# Altium schematic sheet Schematic.SchDoc
size 393 x 281 mm; SheetNumber: 1; SheetTotal: 1
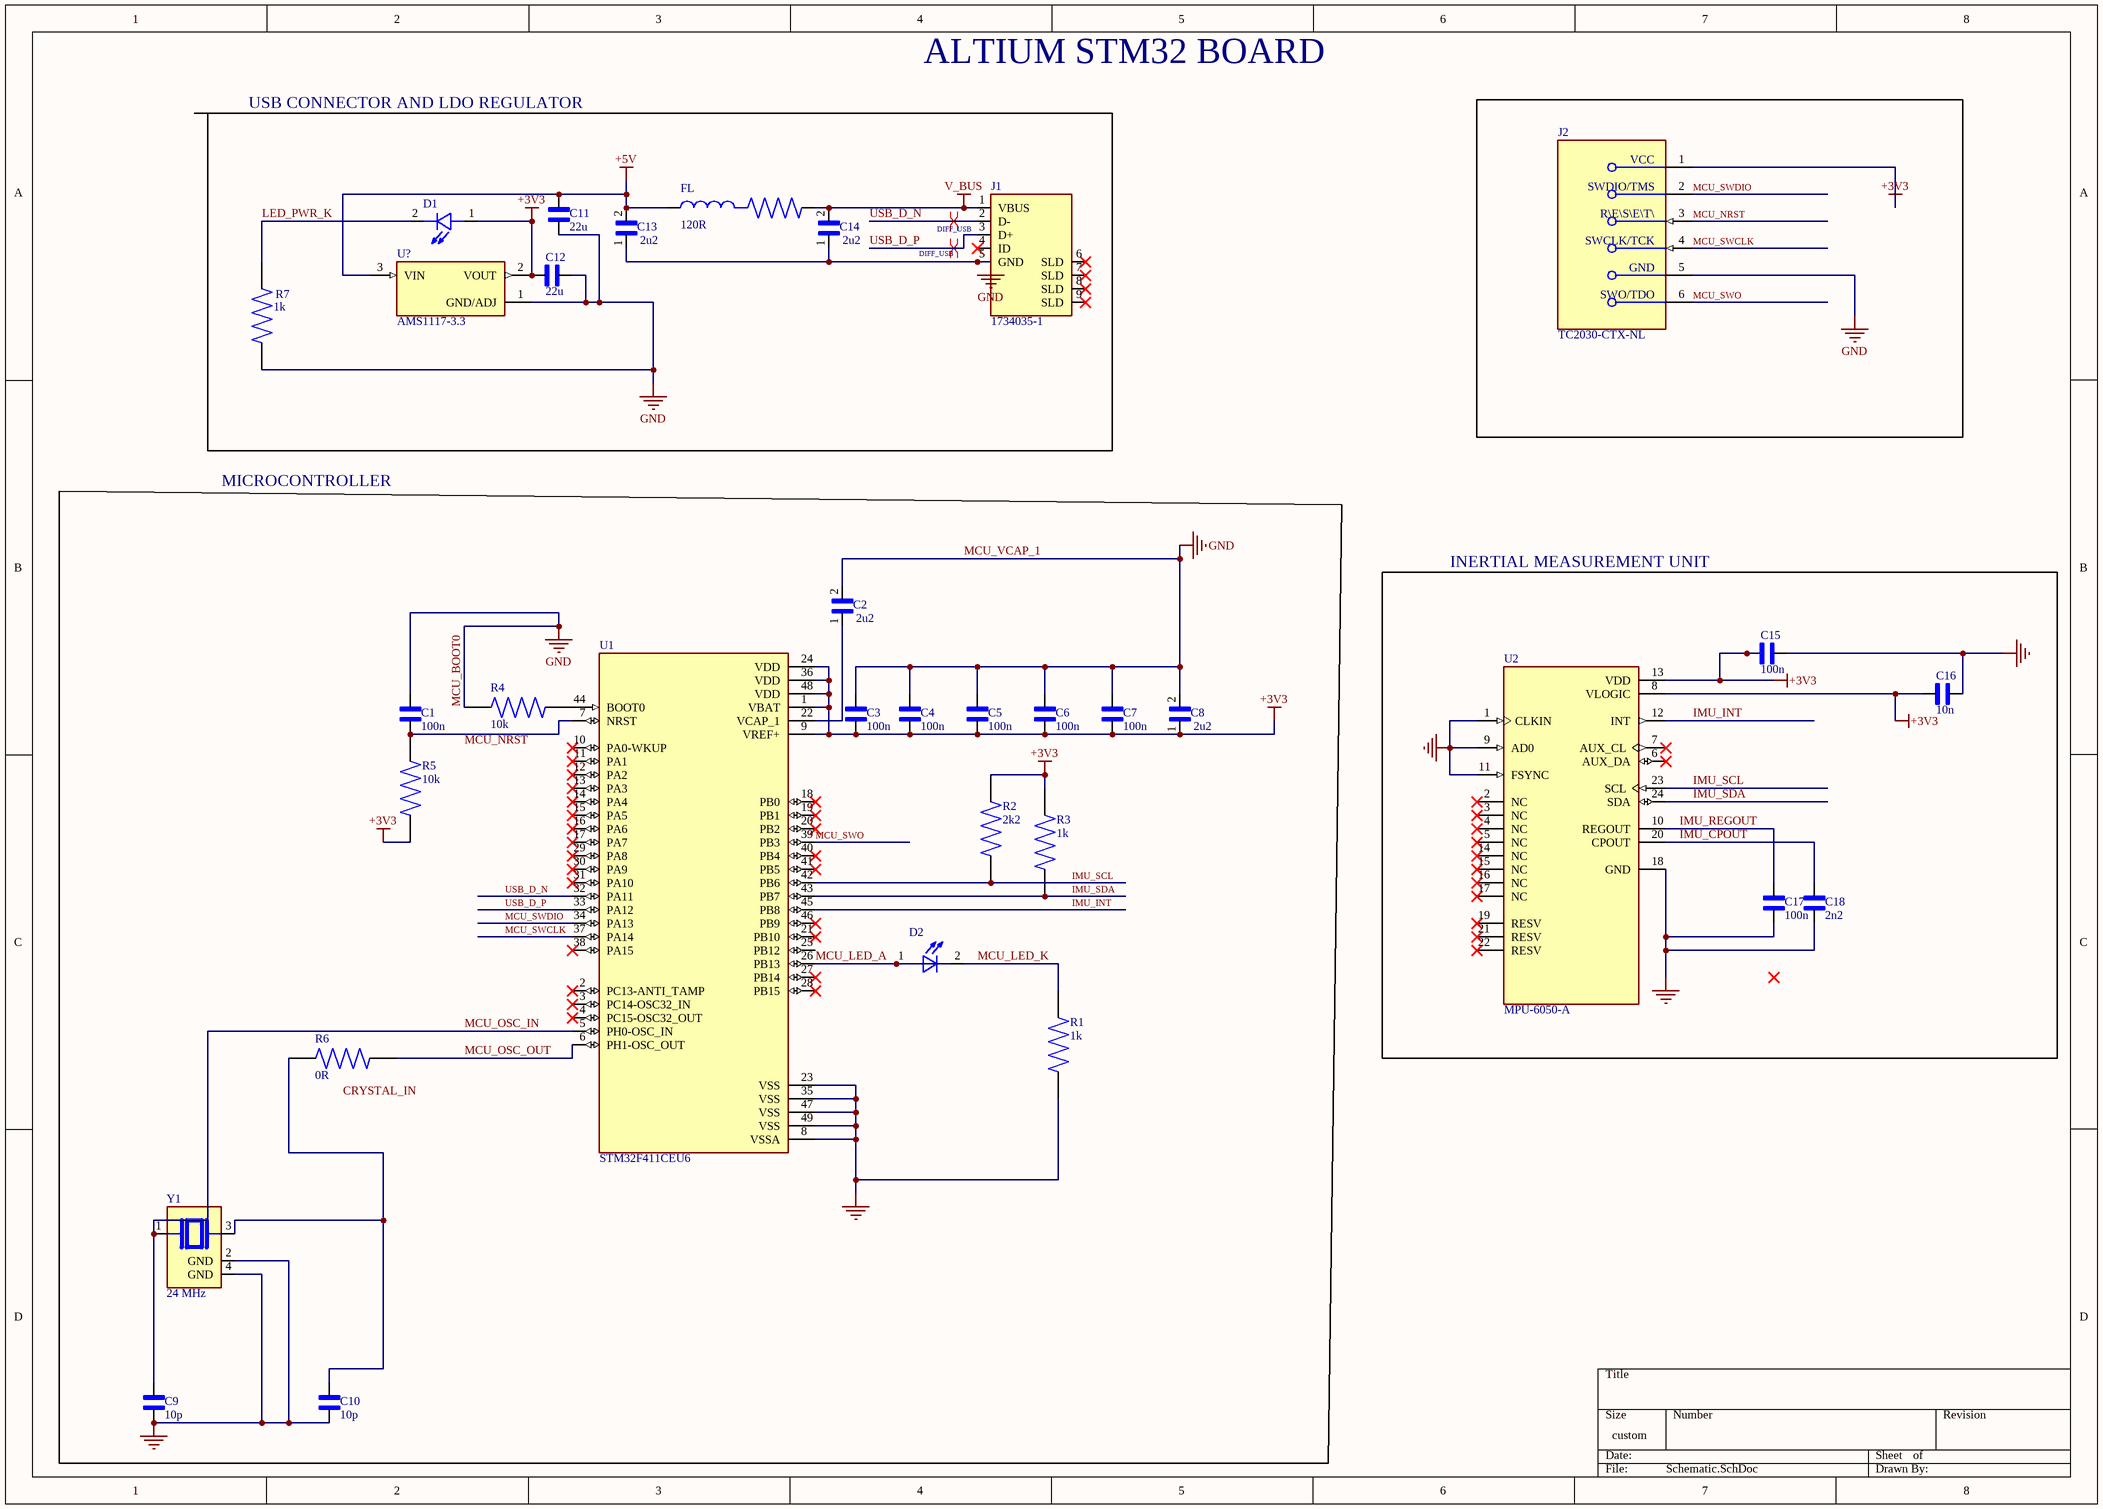
[diagram p0: Schematic.SchDoc]

## Parts
C1  100n  [CAPC1005X55N]
C2  2u2  [CAPC1608X90N]
C3  100n  [CAPC1005X55N]
C4  100n  [CAPC1005X55N]
C5  100n  [CAPC1005X55N]
C6  100n  [CAPC1005X55N]
C7  100n  [CAPC1005X55N]
C8  2u2  [CAPC1608X90N]
C9  10p  [CAPC1005X55N]
C10  10p  [CAPC1005X55N]
C11  22u  [CAPC2012X88N]
C12  22u  [CAPC2012X88N]
C13  2u2  [CAPC1608X90N]
C14  2u2  [CAPC1608X90N]
C15  100n  [CAPC1005X55N]
C16  10n  [CAPC1005X55N]
C17  100n  [CAPC1005X55N]
C18  2n2  [CAPC1005X55N]
D1  (no value)  [LED_XZMG54W-1]
D2  (no value)  [LED_XZMG54W-1]
FL  120R  [FIL_NFZ5BBW7R6LZ10L]
J1  1734035-1  [TE_1734035-1]
J2  TC2030-CTX-NL  [FP-TC2030-CTX-NL-MFG]
R1  1k  [RES_ERJU02F3600X]
R2  2k2  [RES_ERJU02F3600X]
R3  1k  [RES_ERJU02F3600X]
R4  10k  [RES_ERJU02F3600X]
R5  10k  [RES_ERJU02F3600X]
R6  0R  [RES_ERJU02F3600X]
R7  1k  [RES_ERJU02F3600X]
U1  STM32F411CEU6  [QFN50P700X700X60-49N]
U2  MPU-6050-A  [QFN50P400X400X95-24N]
U?  AMS1117-3.3  [SOT229P700X180-4N]
Y1  24 MHz  [XTAL_C7S-24.000-12-3030-X-R]

## Blocks framed on the sheet
MICROCONTROLLER: C1-C10 D2 R1-R6 U1 Y1
INERTIAL MEASUREMENT UNIT: C15-C18 U2

## Nets
+3V3: C3.1 C4.1 C5.1 C6.1 C7.1 C8.1 C12.2 C15.2 C16.2 D1.1(A) J2.1(VCC) R2.1 R3.1 R5.2 U1.1(VBAT) U1.9(VREF+) U1.24(VDD) U1.36(VDD) U1.48(VDD) U2.8(VLOGIC) U2.13(VDD) U?.2(VOUT)
+5V: C11.1 C13.2 FL.1 U?.3(VIN)
MCU_BOOT0: C1.2 C2.2 C3.2 C4.2 C5.2 C6.2 C7.2 C8.2 C11.2 C12.1 C13.1 C14.1 J1.5(GND) J2.5(GND) R4.2 R7.2 U?.1(GND/ADJ)  [also labelled GND, MCU_VCAP_1]
NetC9_1: C9.1 C10.1 C15.1 C16.1 C17.2 C18.2 R1.2 U1.8(VSSA) U1.23(VSS) U1.35(VSS) U1.47(VSS) U1.49(VSS) U2.1(CLKIN) U2.9(AD0) U2.11(FSYNC) U2.18(GND) Y1.2(GND) Y1.4(GND)
V_BUS: C14.2 FL.2 J1.1(VBUS)
IMU_CPOUT: C18.1 U2.20(CPOUT)
IMU_INT: U1.45(PB8) U2.12(INT)
IMU_REGOUT: C17.1 U2.10(REGOUT)
IMU_SCL: R2.2 U1.42(PB6) U2.23(SCL)
IMU_SDA: R3.2 U1.43(PB7) U2.24(SDA)
LED_PWR_K: D1.2(C) R7.1
MCU_LED_A: D2.1(A) U1.26(PB13)
MCU_LED_K: D2.2(C) R1.1
MCU_NRST: J2.3(~{RESET})
MCU_OSC_IN: C9.2 U1.5(PH0-OSC_IN) Y1.1
MCU_OSC_OUT: R6.2 U1.6(PH1-OSC_OUT)
MCU_SWCLK: J2.4(SWCLK/TCK) U1.37(PA14)
MCU_SWDIO: J2.2(SWDIO/TMS) U1.34(PA13)
MCU_SWO: J2.6(SWO/TDO) U1.39(PB3)
USB_D_N: J1.2(D-) U1.32(PA11)
USB_D_P: J1.3(D+) U1.33(PA12)
NetC1_1: C1.1 R5.1 U1.7(NRST)
NetC2_1: C2.1 U1.22(VCAP_1)
NetC10_2: C10.2 R6.1 Y1.3
NetR4_1: R4.1 U1.44(BOOT0)

Not connected (* = marked no-connect by the designer): J1 4(ID)* 6(SLD)* 7(SLD)* 8(SLD)* 9(SLD)*; U1 2(PC13-ANTI_TAMP)* 3(PC14-OSC32_IN)* 4(PC15-OSC32_OUT)* 10(PA0-WKUP)* 11(PA1)* 12(PA2)* 13(PA3)* 14(PA4)* 15(PA5)* 16(PA6)* 17(PA7)* 18(PB0)* 19(PB1)* 20(PB2)* 21(PB10)* 25(PB12) 27(PB14)* 28(PB15)* 29(PA8)* 30(PA9)* 31(PA10)* 38(PA15)* 40(PB4)* 41(PB5)* 46(PB9)*; U2 2(NC)* 3(NC)* 4(NC)* 5(NC)* 6(AUX_DA)* 7(AUX_CL)* 14(NC)* 15(NC)* 16(NC)* 17(NC)* 19(RESV)* 21(RESV)* 22(RESV)*

## Layout directives
differential pair; differential pair class DIFF_USB: USB_D_N, USB_D_P

## Notes on the sheet
- USB CONNECTOR AND LDO REGULATOR
- ALTIUM STM32 BOARD
- Labels drawn without touching a wire or pin: CRYSTAL_IN, MCU_NRST

## Library data of the parts
C1 C3-C7 C9 C10 C15-C18 = C0402C104K4RALTU: 0.1 ÂµF Â±10% 16V Ceramic Capacitor X7R 0402 (1005 Metric); MF: KEMET; SnapEDA_Link: https://www.snapeda.com/parts/C0402C104K4RALTU/KEMET/view-part/?ref=snap; Package: 0402 KEMET; Value: *; MP: C0402C104K4RALTU; Check_prices: https://www.snapeda.com/parts/C0402C104K4RALTU/KEMET/view-part/?ref=eda
C2 C8 C13 C14 = C0603C225K4PACTU: 2.2ÂµF Â±10% 16V Ceramic Capacitor X5R 0603 _1608 Metric_; MF: KEMET; SnapEDA_Link: https://www.snapeda.com/parts/C0603C225K4PACTU/KEMET/view-part/609526/?ref=snap; Value: *; Availability: Unavailable; Price: None; MP: C0603C225K4PACTU; Package: 0603 KEMET
C11 C12 = C0805C475K4PACTU: 4.7 ÂµF Â±10% 16V Ceramic Capacitor X5R 0805 (2012 Metric); MF: KEMET; SnapEDA_Link: https://www.snapeda.com/parts/C0805C475K4PACTU/KEMET/view-part/?ref=snap; Package: 0805 Kemet; Value: *; MP: C0805C475K4PACTU; Check_prices: https://www.snapeda.com/parts/C0805C475K4PACTU/KEMET/view-part/?ref=eda
D1 D2 = XZMG54W-1: Green 568nm LED Indication - Discrete 2.2V 0805 (2012 Metric); MF: SunLED; SnapEDA_Link: https://www.snapeda.com/parts/XZMG54W-1/SunLED/view-part/?ref=snap; Purchase-URL: https://pricing.snapeda.com/search/part/XZMG54W-1/?ref=eda; Price: None; Availability: In Stock; Package: None; Check_prices: https://www.snapeda.com/parts/XZMG54W-1/SunLED/view-part/?ref=eda; Value: *; MP: XZMG54W-1
FL = NFZ5BBW7R6LZ10L: Ferrite Bead; MF: Murata; MP: NFZ5BBW7R6LZ10L; Value: *; Availability: Unavailable; Package: None; Price: None; SnapEDA_Link: https://www.snapeda.com/parts/NFZ5BBW7R6LZ10L/Murata/view-part/2730020/?ref=snap; Arrow_Electronics-Purchase-URL: https://snapeda.com/shop?store=Arrow+Electronics&id=2730020
J1 = 1734035-1: Conn Data USB Mini Recept 2.0 5 Pos 1 Port Rt Angle B Ser SMT Gold/Nickel | TE Connectivity 1734035-1; SnapEDA_Link: https://www.snapeda.com/parts/1734035-1/TE+Connectivity+AMP+Connectors/view-part/?ref=snap; Package: None; Value: *; MF: TE Connectivity; MP: 1734035-1; Check_prices: https://www.snapeda.com/parts/1734035-1/TE+Connectivity+AMP+Connectors/view-part/?ref=eda
J2 = CMP-205963-000001-1: 6-Pin “No legs” TC2030 Plug-of-Nails™ Cable for use with ARM Cortex processors
R1-R7 = ERJU02F3600X: Price: None; Value: *; MP: ERJU02F3600X; Package: None; Availability: Unavailable
U1 = STM32F411CEU6: High-performance access line, ARM Cortex-M4 core with DSP and FPU, 512 Kbytes Flash, 100 MHz CPU, ART Accelerator; Package: None; Availability: Unavailable; Value: *; MP: STM32F411CEU6; Price: None
U2 = MPU-6050-A: MF: TDK InvenSense; SnapEDA_Link: https://www.snapeda.com/parts/MPU-6050-A/InvenSense/view-part/?ref=snap; Package: None; Value: *; MP: MPU-6050-A; Check_prices: https://www.snapeda.com/parts/MPU-6050-A/InvenSense/view-part/?ref=eda
U? = AMS1117-3.3: Sot223/Pkg 1-Amp 3.3-Volt Low Drop Out Voltage Regulatator; MF: Advanced Monolithic Systems; SnapEDA_Link: https://www.snapeda.com/parts/AMS1117-3.3/Advanced+Monolithic+Systems/view-part/?ref=snap; Package: SOT-223 Seeed Technology; Value: *; MP: AMS1117-3.3; Check_prices: https://www.snapeda.com/parts/AMS1117-3.3/Advanced+Monolithic+Systems/view-part/?ref=eda
Y1 = C7S-24.000-12-3030-X-R: Package: None; Price: None; Value: *; MP: C7S-24.000-12-3030-X-R; Availability: Unavailable